# Altium project ControlSolenoide.PrjPcb
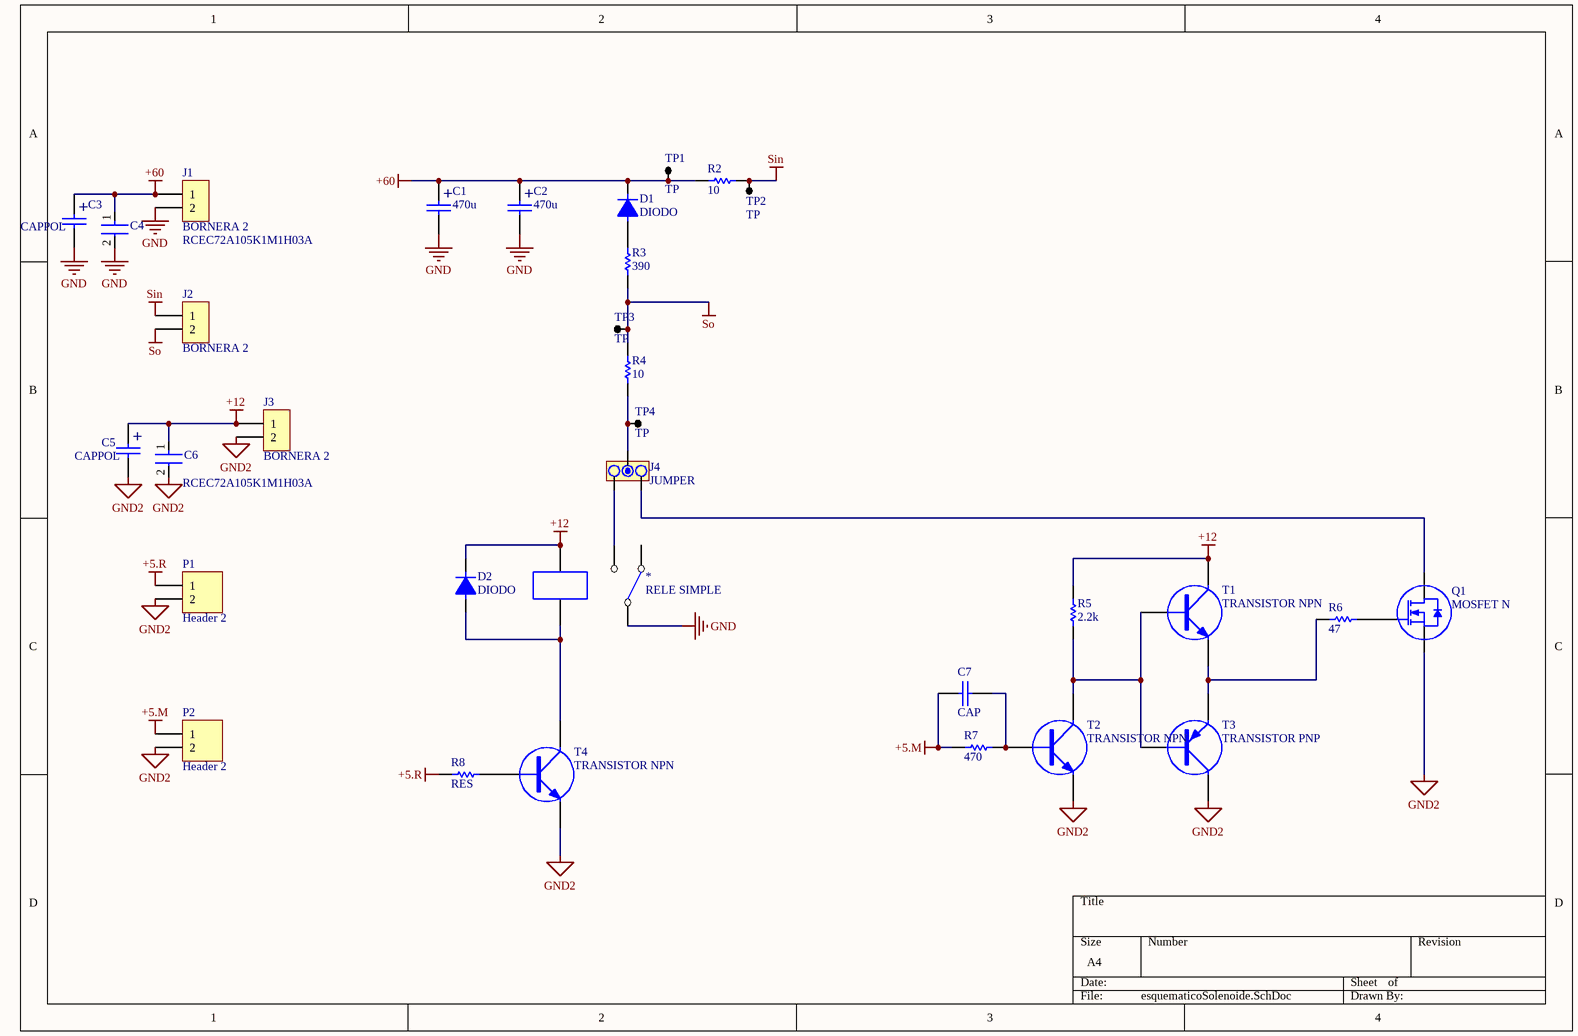
[diagram p0: esquematicoSolenoide.SchDoc]
1 sheet, 32 parts. Net scope: global (net labels, ports and power ports of the same name join across sheets).
Board file: PCB1.PcbDoc

## Sheet esquematicoSolenoide.SchDoc
size A4; SheetNumber: 1; SheetTotal: 1

### Parts
*  RELE SIMPLE  [RELE SERIE 964]
C1  470u  [CAP300RP]
C2  470u  [CAP300RP]
C3  CAPPOL  [CAP100RP]
C4  RCEC72A105K1M1H03A  [FP-RCE1M1-MFG]
C5  CAPPOL  [CAP100RP]
C6  RCEC72A105K1M1H03A  [FP-RCE1M1-MFG]
C7  CAP  [CAP200]
D1  DIODO  [DO41]
D2  DIODO  [DO41]
J1  BORNERA 2  [BORNERA2]
J2  BORNERA 2  [BORNERA2]
J3  BORNERA 2  [BORNERA2]
J4  JUMPER  [JUMPER3]
P1  Header 2  [HDR1X2]
P2  Header 2  [HDR1X2]
Q1  MOSFET N  [TO-220 V]
R2  10  [RES400]
R3  390  [RES400]
R4  10  [RES400]
R5  2.2k  [RES400]
R6  47  [RES400]
R7  470  [RES400]
R8  RES  [RES400]
T1  TRANSISTOR NPN  [TO92]
T2  TRANSISTOR NPN  [TO92]
T3  TRANSISTOR PNP  [TO92]
T4  TRANSISTOR NPN  [TO92]
TP1  TP  [TPTH]
TP2  TP  [TPTH]
TP3  TP  [TPTH]
TP4  TP  [TPTH]

### Nets
+5.M: C7.1 P2.1 R7.1
+5.R: P1.1 R8.2
+12: *.B1 C5.1 C6.1 D2.2 J3.1 R5.1 T1.2(C)
+60: C1.1 C2.1 C3.1 C4.1 D1.2 J1.1 R2.1 TP1.1
GND: *.C1 C1.2 C2.2 C3.2 C4.2 J1.2
GND2: C5.2 C6.2 J3.2 P1.2 P2.2 Q1.3(S) T2.3(E) T3.2(C) T4.3(E)
Sin: J2.1 R2.2 TP2.1
So: J2.2 R3.1 R4.2 TP3.1
Net*_B2: *.B2 D2.1 T4.2(C)
Net*_NA1: *.NA1 J4.3
NetC7_2: C7.2 R7.2 T2.1(B)
NetD1_1: D1.1 R3.2
NetJ4_1: J4.1 Q1.2(D)
NetJ4_2: J4.2 R4.1 TP4.1
NetQ1_1: Q1.1(G) R6.1
NetR5_2: R5.2 T1.1(B) T2.2(C) T3.1(B)
NetR6_2: R6.2 T1.3(E) T3.3(E)
NetR8_1: R8.1 T4.1(B)

Not connected (* = marked no-connect by the designer): * NC1

### Notes on the sheet
- (in symbol CAPPOL) +

### Library data of the parts
C1 C2 = CAPPOL
C4 C6 = CMP-00260-148573932-1: Capacitance: 1µF; Material: Ceramic; Tolerance: 10%; Voltage Rating: 100V; Height: 5mm; Lifecycle Status: Production; Case/Package: Radial; Min Operating Temperature: -55°C; Max Operating Temperature: 125°C
J4 = JUMPER3
P1 P2 = Header 2: Header, 2-Pin; LatestRevisionDate: 17-Jul-2002; LatestRevisionNote: Re-released for DXP Platform.; Publisher: Altium Limited
R2-R7 = RES